# EAGLE schematic MainBoard_V1.3 (EAGLE 7.2.0)
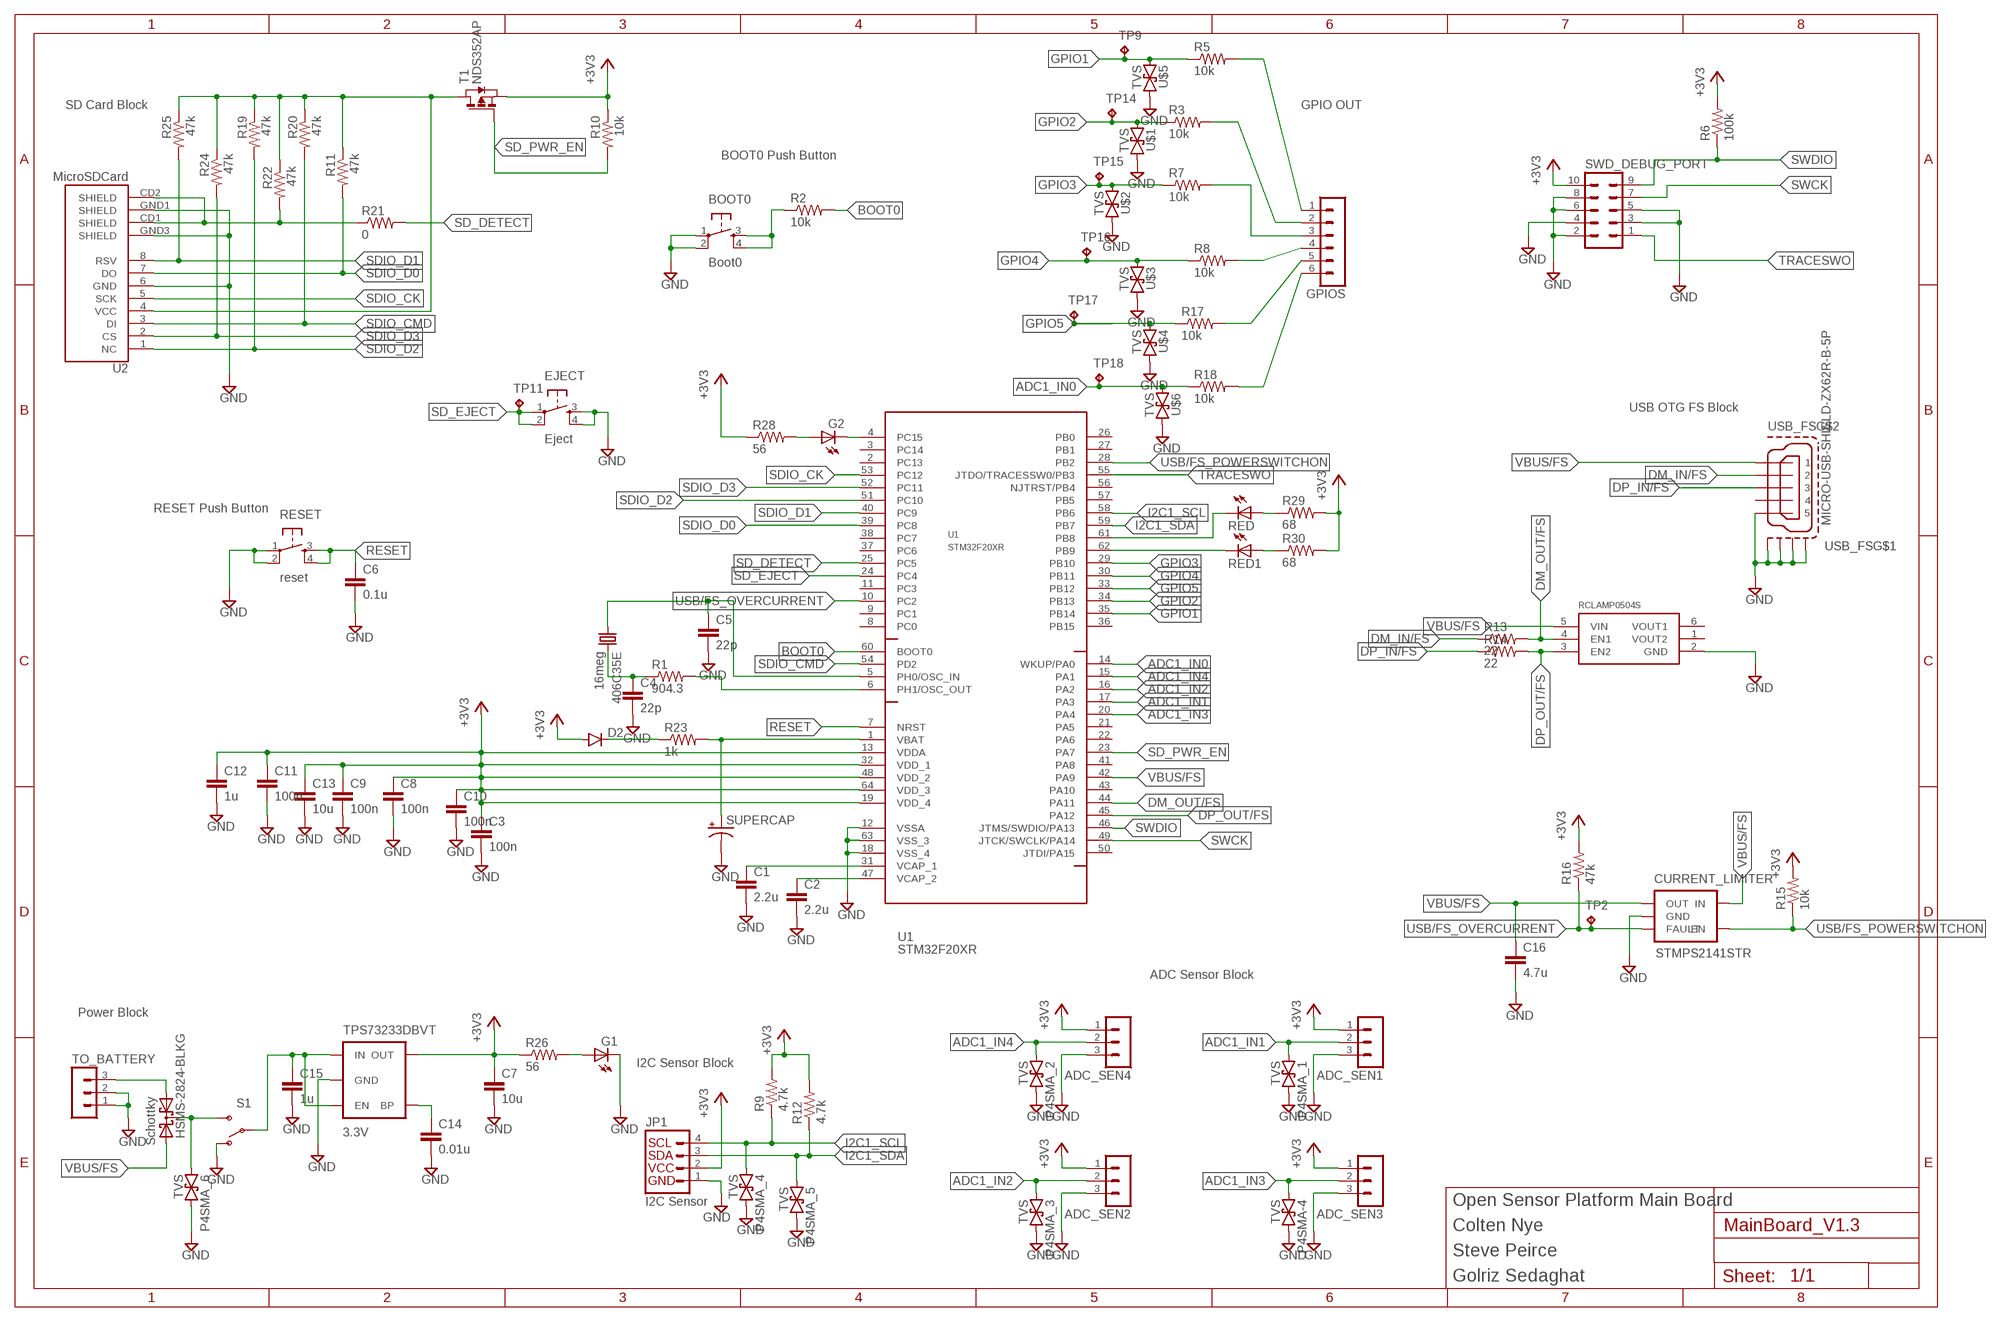
[diagram p0: schematic, sheet 1]

## Parts
406C35E  16meg  CRYSTALCTS406  [CTS406]
ADC_SEN1  MA03-1  [MA03-1]
ADC_SEN2  MA03-1  [MA03-1]
ADC_SEN3  MA03-1  [MA03-1]
ADC_SEN4  MA03-1  [MA03-1]
BOOT0  Boot0  TAC_SWITCHSMD  [TACTILE-SWITCH-SMD]
C1  2.2u  C-EUC0805  [C0805]
C2  2.2u  C-EUC0805  [C0805]
C3  100n  C-EUC0805  [C0805]
C4  22p  C-EUC0805  [C0805]
C5  22p  C-EUC0805  [C0805]
C6  0.1u  C-EUC0805  [C0805]
C7  10u  C-EUC0805  [C0805]
C8  100n  C-EUC0805  [C0805]
C9  100n  C-EUC0805  [C0805]
C10  100n  C-EUC0805  [C0805]
C11  100n  C-EUC0805  [C0805]
C12  1u  C-EUC0805  [C0805]
C13  10u  C-EUC0805  [C0805]
C14  0.01u  C-EUC0805  [C0805]
C15  1u  C-EUC0805  [C0805]
C16  4.7u  C-EUC0805  [C0805]
CURRENT_LIMITER  STMPS2141STR  V_REG_NCP1400SOT23-5  [SOT23-5]
D2  DIODESMA  [SMA-DIODE]
EJECT  Eject  TAC_SWITCHSMD  [TACTILE-SWITCH-SMD]
G1  LEDSML0805  [SML0805]
G2  LEDSML0805  [SML0805]
GPIOS  MA06-1  [MA06-1]
HSMS-2824-BLKG  Schottky  BAS70-05  [SOT23]
JP1  I2C Sensor  I2C_STANDARD  [1X04]
P4SMA-4  TVS  [SMA-DIODE]
P4SMA_1  TVS  [SMA-DIODE]
P4SMA_2  TVS  [SMA-DIODE]
P4SMA_3  TVS  [SMA-DIODE]
P4SMA_4  TVS  [SMA-DIODE]
P4SMA_5  TVS  [SMA-DIODE]
P4SMA_6  TVS  [SMA-DIODE]
R1  904.3  R-US_R0805  [R0805]
R2  10k  R-US_R0805  [R0805]
R3  10k  R-US_R0805  [R0805]
R5  10k  R-US_R0805  [R0805]
R6  100k  R-US_R0805  [R0805]
R7  10k  R-US_R0805  [R0805]
R8  10k  R-US_R0805  [R0805]
R9  4.7k  R-US_R0805  [R0805]
R10  10k  R-US_R0805  [R0805]
R11  47k  R-US_R0805  [R0805]
R12  4.7k  R-US_R0805  [R0805]
R13  22  R-US_R0805  [R0805]
R14  22  R-US_R0805  [R0805]
R15  10k  R-US_R0805  [R0805]
R16  47k  R-US_R0805  [R0805]
R17  10k  R-US_R0805  [R0805]
R18  10k  R-US_R0805  [R0805]
R19  47k  R-US_R0805  [R0805]
R20  47k  R-US_R0805  [R0805]
R21  0  R-US_R0805  [R0805]
R22  47k  R-US_R0805  [R0805]
R23  1k  R-US_R0805  [R0805]
R24  47k  R-US_R0805  [R0805]
R25  47k  R-US_R0805  [R0805]
R26  56  R-US_R0805  [R0805]
R28  56  R-US_R0805  [R0805]
R29  68  R-US_R0805  [R0805]
R30  68  R-US_R0805  [R0805]
RCLAMP0504S  VREG_SOT23-6_DUALAP7312  [SOT23-6]
RED  LEDSML0805  [SML0805]
RED1  LEDSML0805  [SML0805]
RESET  reset  TAC_SWITCHSMD  [TACTILE-SWITCH-SMD]
S1  SWITCH-SPDTSMD  [AYZ0202]
SUPERCAP  SUPERCAP  [414-VA5R]
SWD_DEBUG_PORT  MA05-2  [MA05-2]
T1  NDS352AP  PMOSSOT23  [SOT-23]
TO_BATTERY  MA03-1  [MA03-1]
TP2  TPB1,27  [B1,27]
TP9  TPB1,27  [B1,27]
TP11  TPB1,27  [B1,27]
TP14  TPB1,27  [B1,27]
TP15  TPB1,27  [B1,27]
TP16  TPB1,27  [B1,27]
TP17  TPB1,27  [B1,27]
TP18  TPB1,27  [B1,27]
TPS73233DBVT  3.3V  V_REG_MIC52053.3V  [SOT23-5]
U1  STM32F20XR  [LQFP64]
U2  MicroSDCard  USD-SOCKETNEW  [MICRO-SD-SOCKET-PP]
U$1  TVS  [SMA-DIODE]
U$2  TVS  [SMA-DIODE]
U$3  TVS  [SMA-DIODE]
U$4  TVS  [SMA-DIODE]
U$5  TVS  [SMA-DIODE]
U$6  TVS  [SMA-DIODE]
USB_FS  MICRO-USB-SHIELD-ZX62R-B-5P  [ZX62R-B-5P]

## Nets
+3V3: ADC_SEN1.1 ADC_SEN2.1 ADC_SEN3.1 ADC_SEN4.1 C3.1 C7.1 C8.1 C9.1 C10.1 C11.1 C12.1 C13.1 D2.A JP1.2 R6.2 R9.2 R10.1 R12.2 R15.2 R16.2 R26.1 R28.1 R29.2 R30.2 SWD_DEBUG_PORT.10 T1.2(S) TPS73233DBVT.5(OUT) U1.13(VDDA) U1.19(VDD_4) U1.32(VDD_1) U1.48(VDD_2) U1.64(VDD_3)
ADC1_IN0: R18.1 TP18.TP U1.14(WKUP/PA0) U$6.A
ADC1_IN1: ADC_SEN1.2 P4SMA_1.A U1.17(PA3)
ADC1_IN2: ADC_SEN2.2 P4SMA_3.A U1.16(PA2)
ADC1_IN3: ADC_SEN3.2 P4SMA-4.A U1.20(PA4)
ADC1_IN4: ADC_SEN4.2 P4SMA_2.A U1.15(PA1)
BOOT0: R2.2 U1.60(BOOT0)
DEBUG_LED/NP1: GPIOS.1 R5.2
DEBUG_LED/NP2: GPIOS.2 R3.2
DEBUG_LED/NP3: GPIOS.3 R7.2
DEBUG_LED/NP4: GPIOS.4 R8.2
DEBUG_LED/NP5: GPIOS.5 R17.2
DEBUG_LED/NP6: GPIOS.6 R18.2
DM_IN/FS: R13.1 USB_FS.2
DM_OUT/FS: R13.2 RCLAMP0504S.4(EN1) U1.44(PA11)
DP_IN/FS: R14.1 USB_FS.3
DP_OUT/FS: R14.2 RCLAMP0504S.3(EN2) U1.45(PA12)
GND: ADC_SEN1.3 ADC_SEN2.3 ADC_SEN3.3 ADC_SEN4.3 BOOT0.1 BOOT0.2 C1.2 C2.2 C3.2 C4.2 C5.2 C6.2 C7.2 C8.2 C9.2 C10.2 C11.2 C12.2 C13.2 C14.2 C15.2 C16.2 CURRENT_LIMITER.4(GND) EJECT.3 EJECT.4 G1.C JP1.1 P4SMA-4.C P4SMA_1.C P4SMA_2.C P4SMA_3.C P4SMA_4.C P4SMA_5.C P4SMA_6.C RCLAMP0504S.2(GND) RESET.1 RESET.2 S1.1(O) SUPERCAP.- SWD_DEBUG_PORT.2 SWD_DEBUG_PORT.3 SWD_DEBUG_PORT.4 SWD_DEBUG_PORT.5 SWD_DEBUG_PORT.6 SWD_DEBUG_PORT.8 TO_BATTERY.1 TO_BATTERY.2 TPS73233DBVT.2(GND) U1.12(VSSA) U1.18(VSS_4) U1.63(VSS_3) U2.6(GND) U2.GND1(SHIELD) U2.GND3(SHIELD) U$1.C U$2.C U$3.C U$4.C U$5.C U$6.C USB_FS.5 USB_FS.M1(S1) USB_FS.M2(S2) USB_FS.M3(S3) USB_FS.M4(S4)
GPIO1: R5.1 TP9.TP U1.35(PB14) U$5.A
GPIO2: R3.1 TP14.TP U1.34(PB13) U$1.A
GPIO3: R7.1 TP15.TP U1.29(PB10) U$2.A
GPIO4: R8.1 TP16.TP U1.30(PB11) U$3.A
GPIO5: R17.1 TP17.TP U1.33(PB12) U$4.A
I2C1_SCL: JP1.4 P4SMA_4.A R9.1 U1.58(PB6)
I2C1_SDA: JP1.3 P4SMA_5.A R12.1 U1.59(PB7)
N$1: C1.1 U1.31(VCAP_1)
N$2: C2.1 U1.47(VCAP_2)
N$3: G2.C U1.4(PC15)
N$4: HSMS-2824-BLKG.1(A1) TO_BATTERY.3
N$5: 406C35E.3 C4.1 R1.1
N$6: BOOT0.3 BOOT0.4 R2.1
N$7: G1.A R26.2
N$9: R1.2 U1.6(PH1/OSC_OUT)
N$10: C14.1 TPS73233DBVT.4(BP)
N$13: RED1.C U1.62(PB9)
N$14: R21.1 R22.2 U2.CD1(SHIELD) U2.CD2(SHIELD)
N$15: D2.C R23.1
N$16: R29.1 RED.A
N$17: G2.A R28.2
N$18: R30.1 RED1.A
N$20: RED.C U1.61(PB8)
N$21: HSMS-2824-BLKG.3(C) P4SMA_6.A S1.3(S)
N$26: R11.1 R19.1 R20.1 R22.1 R24.1 R25.1 T1.1(D) U2.4(VCC)
OSC_IN: 406C35E.1 C5.1 U1.5(PH0/OSC_IN)
RESET: C6.1 RESET.3 RESET.4 U1.7(NRST)
SD_DETECT: R21.2 U1.25(PC5)
SD_EJECT: EJECT.1 EJECT.2 TP11.TP U1.24(PC4)
SD_PWR_EN: R10.2 T1.3(G) U1.23(PA7)
SDIO_CK: U1.53(PC12) U2.5(SCK)
SDIO_CMD: R20.2 U1.54(PD2) U2.3(DI)
SDIO_D0: R11.2 U1.39(PC8) U2.7(DO)
SDIO_D1: R25.2 U1.40(PC9) U2.8(RSV)
SDIO_D2: R19.2 U1.51(PC10) U2.1(NC)
SDIO_D3: R24.2 U1.52(PC11) U2.2(CS)
SWCK: SWD_DEBUG_PORT.7 U1.49(JTCK/SWCLK/PA14)
SWDIO: R6.1 SWD_DEBUG_PORT.9 U1.46(JTMS/SWDIO/PA13)
TRACESWO: SWD_DEBUG_PORT.1 U1.55(JTDO/TRACESSW0/PB3)
USB/FS_OVERCURRENT: CURRENT_LIMITER.3(FAULT) R16.1 TP2.TP U1.10(PC2)
USB/FS_POWERSWITCHON: CURRENT_LIMITER.1(EN) R15.1 U1.28(PB2)
VBAT: R23.2 SUPERCAP.+ U1.1(VBAT)
VBUS/FS: C16.1 CURRENT_LIMITER.2(OUT) CURRENT_LIMITER.5(IN) HSMS-2824-BLKG.2(A2) RCLAMP0504S.5(VIN) U1.42(PA9) USB_FS.1
VIN: C15.1 S1.2(P) TPS73233DBVT.1(IN) TPS73233DBVT.3(EN)
Unconnected: RCLAMP0504S.1(VOUT2) RCLAMP0504S.6(VOUT1) U1.2(PC13) U1.3(PC14) U1.8(PC0) U1.9(PC1) U1.11(PC3) U1.21(PA5) U1.22(PA6) U1.26(PB0) U1.27(PB1) U1.36(PB15) U1.37(PC6) U1.38(PC7) U1.41(PA8) U1.43(PA10) U1.50(JTDI/PA15) U1.56(NJTRST/PB4) U1.57(PB5) USB_FS.4

## Notes on the sheet
- SD Card Block | GPIO OUT
- BOOT0 Push Button
- USB OTG FS Block
- RESET Push Button
- ADC Sensor Block
- Power Block
- I2C Sensor Block
- Open Sensor Platform Main Board
- Colten Nye
- Steve Peirce
- Golriz Sedaghat

## Library data of the parts
406C35E = crystal:CRYSTAL: CRYSTAL; OC_FARNELL: unknown; OC_NEWARK: unknown
ADC_SEN1-ADC_SEN4 TO_BATTERY = con-lstb:MA03-1: PIN HEADER; OC_FARNELL: unknown; OC_NEWARK: unknown
BOOT0 EJECT RESET = SparkFun-Electromechanical:TAC_SWITCH: Momentary Switch Button commonly used for reset or general input. Spark Fun Electronics SKU : COM-00097 SMT- SWCH-08247; PROD_ID: SWCH-08247; VALUE: TAC_SWITCHSMD
C1-C16 = rcl:C-EU: CAPACITOR, European symbol
CURRENT_LIMITER = SparkFun-PowerIC:V_REG_NCP1400: Switching step-up voltage regulator NCP1400 switiching regulator takes single cell AA and outputs 100mA at 3.3V or 5V with minimal number of external components.
D2 = SparkFun-DiscreteSemi:DIODE: Diode These are standard reverse protection diodes and small signal diodes. SMA package can handle up to about 1A. SOD-323 can handle about 200mA. What the SOD-323 package when ordering, there are some mfgs out there that are 5-pin packages.
G1 G2 RED RED1 = led:LED: LED OSRAM: - CHIPLED LG R971, LG N971, LY N971, LG Q971, LY Q971, LO R971, LY R971 LH N974, LH R974 LS Q976, LO Q976, LY Q976 LO Q996 - Hyper CHIPLED LW Q18S LB Q993, LB Q99A, LB R99A - SideLED LS A670, LO A670, LY A670, LG A670, LP A670 LB A673, LV A673, LT A673, LW A673 LH A674 LY A675 LS A676, LA A676, LO A676, LY A676, LW A676 LS A679, LY A679, LG A679 - Hyper Micro SIDELED® LS Y876, LA Y876, LO Y876, LY Y876 LT Y87S - SmartLED LW L88C, LW L88S LB L89C, LB L89S, LG L890 LS L89K, LO L89K, LY L89K LS L896, LA L896, LO L896, LY L896 - TOPLED LS T670, LO T670, LY T670, LG T670, LP T670 LSG T670, LSP T670, LSY T670, LOP T670, LYG T670 LG T671, LOG T671, LSG T671 LB T673, LV T673, LT T673, LW T673 LH T674 LS T676, LA T676, LO T676, LY T676, LB T676, LH T676, LSB T676, LW T676 LB T67C, LV T67C, LT T67C, LS T67K, LO T67K, LY T67K, LW E67C LS E67B, LA E67B, LO E67B, LY E67B, LB E67C, LV E67C, LT E67C LW T67C LS T679, LY T679, LG T679 LS T770, LO T770, LY T770, LG T770, LP T770 LB T773, LV T773, LT T773, LW T773 LH T774 LS E675, LA E675, LY E675, LS T675 LS T776, LA T776, LO T776, LY T776, LB T776 LHGB T686 LT T68C, LB T68C - Hyper Mini TOPLED® LB M676 - Mini TOPLED Santana® LG M470 LS M47K, LO M47K, LY M47K Source: http://www.osram.convergy.de LUXEON: - LUMILED® LXK2-PW12-R00, LXK2-PW12-S00, LXK2-PW14-U00, LXK2-PW14-V00 LXK2-PM12-R00, LXK2-PM12-S00, LXK2-PM14-U00 LXK2-PE12-Q00, LXK2-PE12-R00, LXK2-PE12-S00, LXK2-PE14-T00, LXK2-PE14-U00 LXK2-PB12-K00, LXK2-PB12-L00, LXK2-PB12-M00, LXK2-PB14-N00, LXK2-PB14-P00, LXK2-PB14-Q00 LXK2-PR12-L00, LXK2-PR12-M00, LXK2-PR14-Q00, LXK2-PR14-R00 LXK2-PD12-Q00, LXK2-PD12-R00, LXK2-PD12-S00 LXK2-PH12-R00, LXK2-PH12-S00 LXK2-PL12-P00, LXK2-PL12-Q00, LXK2-PL12-R00 Source: www.luxeon.com KINGBRIGHT: KA-3528ASYC Source: www.kingbright.com
GPIOS = con-lstb:MA06-1: PIN HEADER; OC_FARNELL: unknown; OC_NEWARK: unknown
HSMS-2824-BLKG = diode:BAS70-05: Silicon Schottky Diodes General-purpose diode for high-speed switching
JP1 = SparkFun-Connectors:I2C_STANDARD: SparkFun has standardized on a pinout for all I2C based sensor breakouts. This pinout allows I2C boards to be plugged directly into the headers on Arduino Uno compatible boards, and to be daisy chained easily.
P4SMA-4 P4SMA_1-P4SMA_6 U$1-U$6 = SparkFun-DiscreteSemi:TVS: Transient voltage suppressor- prevents ESD on inputs. Ignore package description- MBRA140 is NOT this type of part!!!
R1-R3 R5-R26 R28-R30 = rcl:R-US_: RESISTOR, American symbol
RCLAMP0504S = microbuilder:VREG_SOT23-6_DUAL: Dual Output SOT23-6 Linear Regulators Diodes Inc. AP7312 - Dual 150mA LDO Linear Regulator 0.2V dropout, 150mA output, 2-6V Input AP7312-1833W6-7 - 1.8V/3.3V SOT23-6 (Digikey: AP7312-1833W6-7DICT-ND) MIC5320 - Dual 150mA ULDO Linear Regulator Ultra-low 35mV dropout at 150mA, 2.3-5.5V Input 3.3V/1.8V SOT23-6 (Digikey: 576-1658-1-ND) 3.3V/1.5V SOT23-6 (Digikey: 576-3483-1-ND)
S1 = SparkFun-Electromechanical:SWITCH-SPDT: SPDT Switch Simple slide switch, Spark Fun Electronics SKU : COM-00102 DPDT SMT slide switch, AYZ0202, SWCH-08179; PROD_ID: SWCH-08179
SUPERCAP = adafruit:SUPERCAP
SWD_DEBUG_PORT = con-lstb:MA05-2: PIN HEADER; OC_FARNELL: unknown; OC_NEWARK: unknown
T1 = zetex:PMOSSOT23: MOS FET; OC_FARNELL: unknown; OC_NEWARK: unknown
TP2 TP9 TP11 TP14-TP18 = testpad:TP: Test pad
TPS73233DBVT = SparkFun-PowerIC:V_REG_MIC5205: V_REG MIC5219 Standard 3.3V and 5V 150mA LDO voltage regulator in SOT-23 layout. Micrel part MIC5205. BP (by-pass) pin is used to lower output noise with 470pF cap, may be left open.; PROD_ID: VREG-00822; VALUE: 3.3V/150mA
U1 = stm32F:STM32F20XR
U2 = SparkFun-Connectors:USD-SOCKET: microSD Socket Push-push type uSD socket. Schematic element and footprint production proven. Spark Fun Electronics SKU : PRT-00127. tDoc lines correctly indicate media card edge positions when inserting (unlocked, locked, depressed).
USB_FS = con-hirose:MICRO-USB-SHIELD-: Hirose Micro USB Connector ZX62R-B-5P: Micro B, reverse (top mount) shell SMT Supplier: DigiKey H11574CT-ND Source: http://www.hirose.co.jp/cataloge_hp/e24200011.pdf